# EAGLE design cnc_shield (EAGLE 5.10)
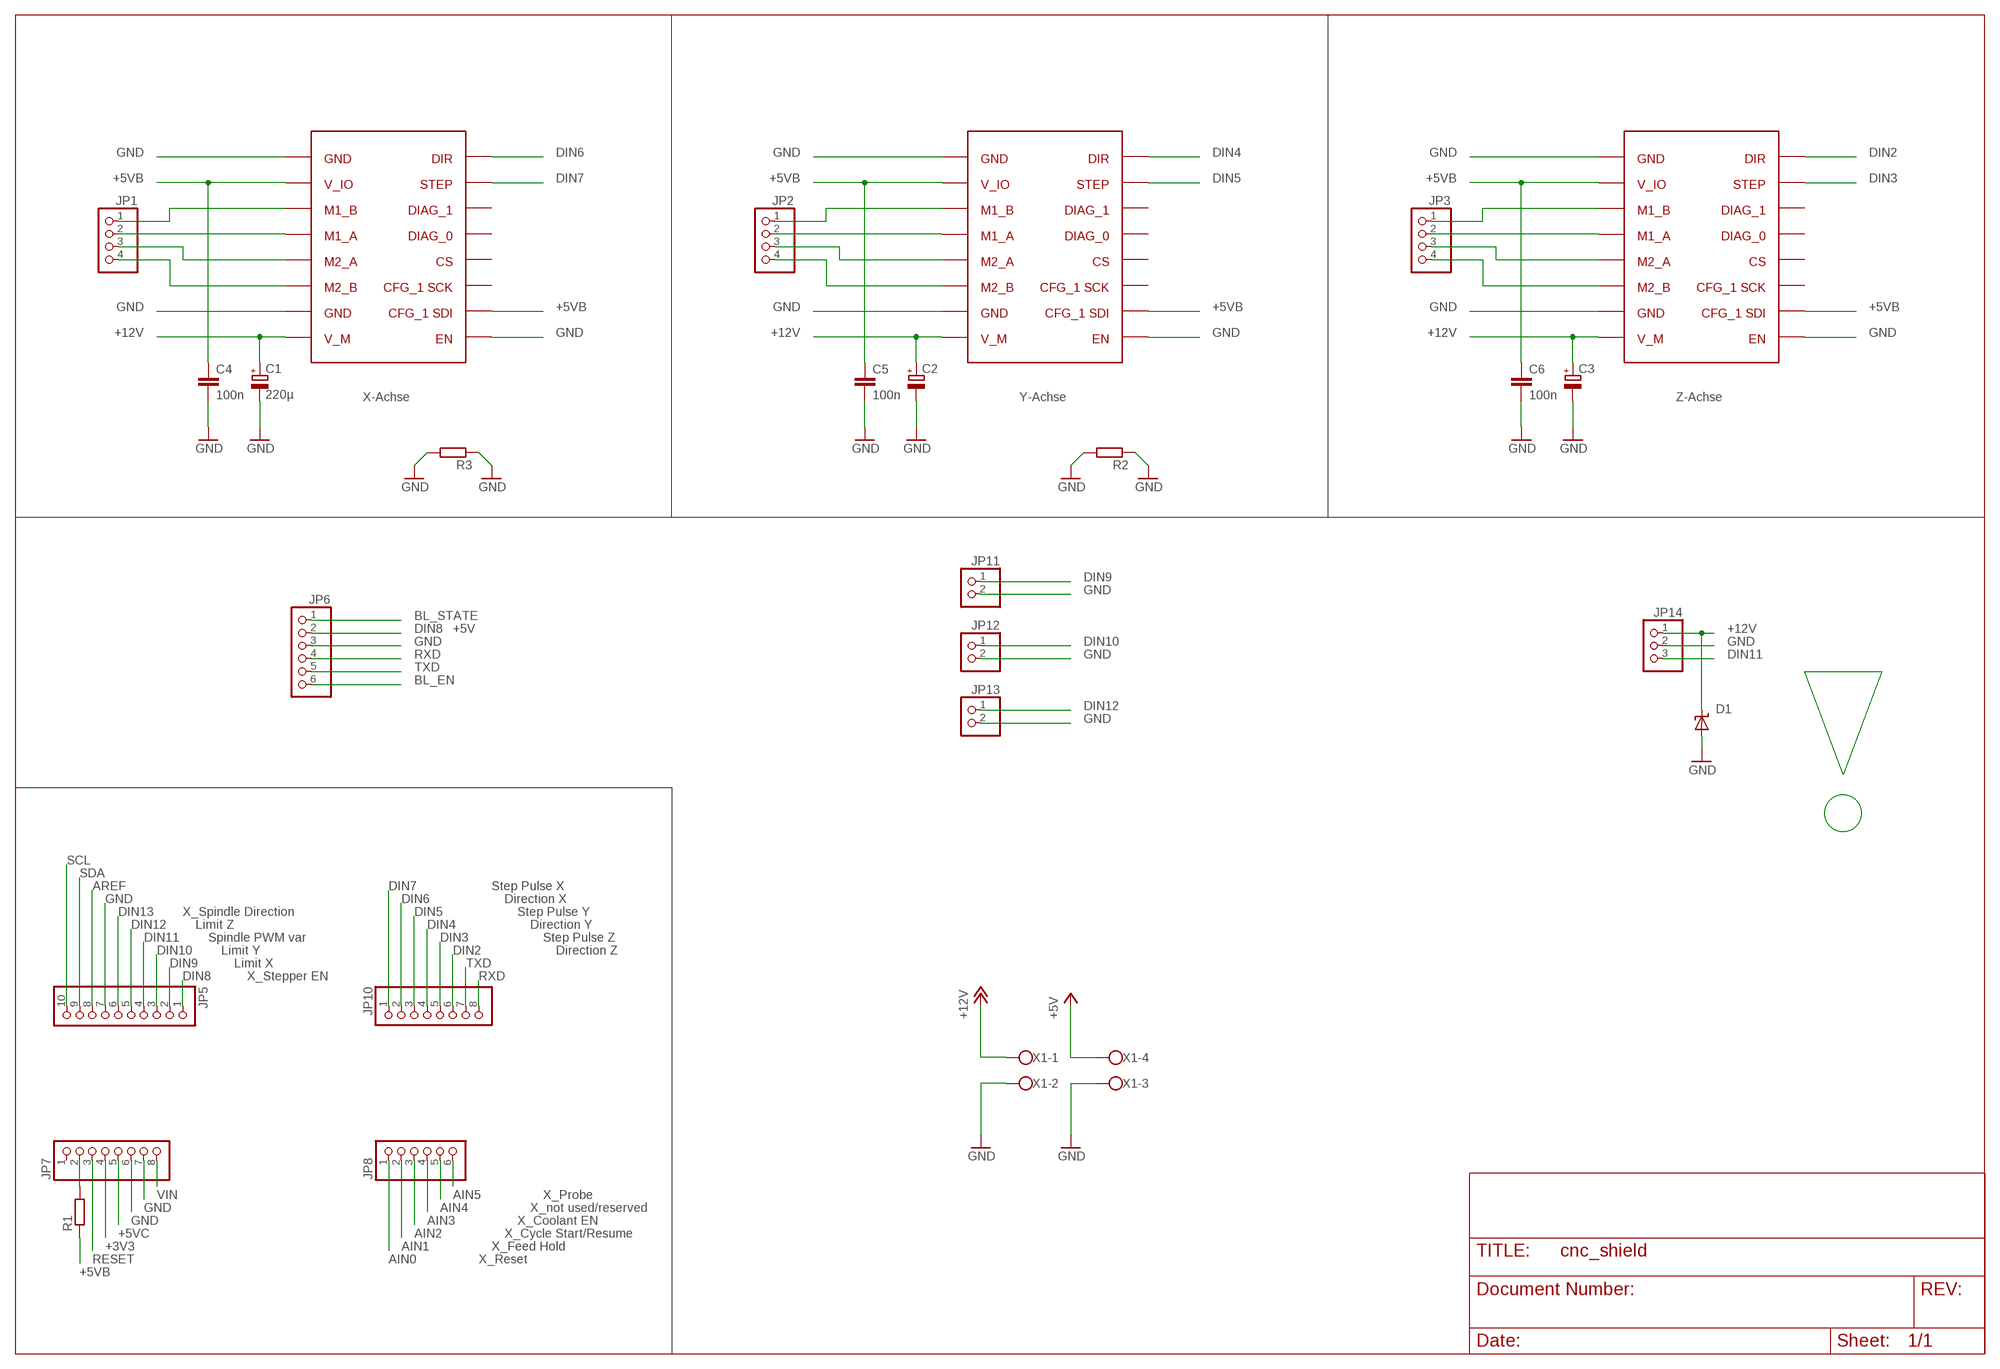
[diagram p0: schematic, sheet 1]

## Parts
C1  220µ  CPOL-EUTT2D4  [TT2D4]
C2  CPOL-EUTT2D4  [TT2D4]
C3  CPOL-EUTT2D4  [TT2D4]
C4  100n  C-EUC0805  [C0805]
C5  100n  C-EUC0805  [C0805]
C6  100n  C-EUC0805  [C0805]
D1  SUPPRESSOR-SMBG  [SMBG]
JP1  PINHD-1X4/90  [1X04/90]
JP2  PINHD-1X4/90  [1X04/90]
JP3  PINHD-1X4/90  [1X04/90]
JP5  PINHD-1X10  [1X10]
JP6  PINHD-1X6  [1X06]
JP7  PINHD-1X8  [1X08]
JP8  PINHD-1X6  [1X06]
JP10  PINHD-1X8  [1X08]
JP11  PINHD-1X2  [1X02]
JP12  PINHD-1X2  [1X02]
JP13  PINHD-1X2  [1X02]
JP14  PINHD-1X3  [1X03]
R1  R-EU_M1206  [M1206]
R2  R-EU_M1206  [M1206]
R3  R-EU_M1206  [M1206]
U$1  TMC2130  [TMC2130]
U$2  TMC2130  [TMC2130]
U$3  TMC2130  [TMC2130]
X1  W237-4  [W237-4]

## Nets
+3V3: JP7.4
+5V: JP7.2 R1.2 X1.4
+5VB: C4.1 C5.1 C6.1 R1.1 U$1.P$2(V_IO) U$1.P$10(CFG0_SDI) U$2.P$2(V_IO) U$2.P$10(CFG0_SDI) U$3.P$2(V_IO) U$3.P$10(CFG0_SDI)
+5VC: JP7.5
+12V: C1.+ C2.+ C3.+ D1.C JP14.1 U$1.P$8(V_M) U$2.P$8(V_M) U$3.P$8(V_M) X1.1
AIN0: JP8.1
AIN1: JP8.2
AIN2: JP8.3
AIN3: JP8.4
AIN4: JP8.5
AIN5: JP8.6
AREF: JP5.8
BL_EN: JP6.6
BL_STATE: JP6.1
DIN2: JP10.6 U$3.P$16(DIR)
DIN3: JP10.5 U$3.P$15(STEP)
DIN4: JP10.4 U$2.P$16(DIR)
DIN5: JP10.3 U$2.P$15(STEP)
DIN6: JP10.2 U$1.P$16(DIR)
DIN7: JP10.1 U$1.P$15(STEP)
DIN8: JP5.1 JP6.2
DIN9: JP5.2 JP11.1
DIN10: JP5.3 JP12.1
DIN11: JP5.4 JP14.3
DIN12: JP5.5 JP13.1
DIN13: JP5.6
GND: C1.- C2.- C3.- C4.2 C5.2 C6.2 D1.A JP5.7 JP6.3 JP7.6 JP7.7 JP11.2 JP12.2 JP13.2 JP14.2 R2.1 R2.2 R3.1 R3.2 U$1.P$1(GND_IO) U$1.P$7(GND_M) U$1.P$9(EN) U$2.P$1(GND_IO) U$2.P$7(GND_M) U$2.P$9(EN) U$3.P$1(GND_IO) U$3.P$7(GND_M) U$3.P$9(EN) X1.2 X1.3
N$1: JP2.1 U$2.P$3(M1B)
N$2: JP2.2 U$2.P$4(M1A)
N$3: JP1.1 U$1.P$3(M1B)
N$4: JP1.2 U$1.P$4(M1A)
N$5: JP1.3 U$1.P$5(M2A)
N$6: JP1.4 U$1.P$6(M2B)
N$7: JP2.3 U$2.P$5(M2A)
N$8: JP2.4 U$2.P$6(M2B)
N$9: JP3.1 U$3.P$3(M1B)
N$10: JP3.2 U$3.P$4(M1A)
N$11: JP3.3 U$3.P$5(M2A)
N$12: JP3.4 U$3.P$6(M2B)
RESET: JP7.3
RXD: JP6.4 JP10.8
SCL: JP5.10
SDA: JP5.9
TXD: JP6.5 JP10.7
VIN: JP7.8
Unconnected: JP7.1 U$1.P$11(CFG1_SCK) U$1.P$12(CS) U$1.P$13(DIAG_0) U$1.P$14(DIAG_1) U$2.P$11(CFG1_SCK) U$2.P$12(CS) U$2.P$13(DIAG_0) U$2.P$14(DIAG_1) U$3.P$11(CFG1_SCK) U$3.P$12(CS) U$3.P$13(DIAG_0) U$3.P$14(DIAG_1)

## Notes on the sheet
- X-Achse | Y-Achse | Z-Achse
- +5V
- Step Pulse X
- Direction X
- X_Spindle Direction | Step Pulse Y
- Limit Z | Direction Y
- Spindle PWM var | Step Pulse Z
- Limit Y | Direction Z
- Limit X
- X_Stepper EN
- X_Probe
- X_not used/reserved
- X_Coolant EN
- X_Cycle Start/Resume
- X_Feed Hold
- X_Reset

## Library data of the parts
C1-C3 = rcl:CPOL-EU: POLARIZED CAPACITOR, European symbol
C4-C6 = rcl:C-EU: CAPACITOR, European symbol
D1 = diode:SUPPRESSOR-: Suppressor diode
JP1-JP3 = pinhead:PINHD-1X4: PIN HEADER
JP5 = pinhead:PINHD-1X10: PIN HEADER
JP6 JP8 = pinhead:PINHD-1X6: PIN HEADER
JP7 JP10 = pinhead:PINHD-1X8: PIN HEADER
JP11-JP13 = pinhead:PINHD-1X2: PIN HEADER
JP14 = pinhead:PINHD-1X3: PIN HEADER
R1-R3 = rcl:R-EU_: RESISTOR, European symbol
U$1-U$3 = tmc2130:TMC2130
X1 = con-wago-500:W237-4: WAGO SCREW CLAMP

## Board
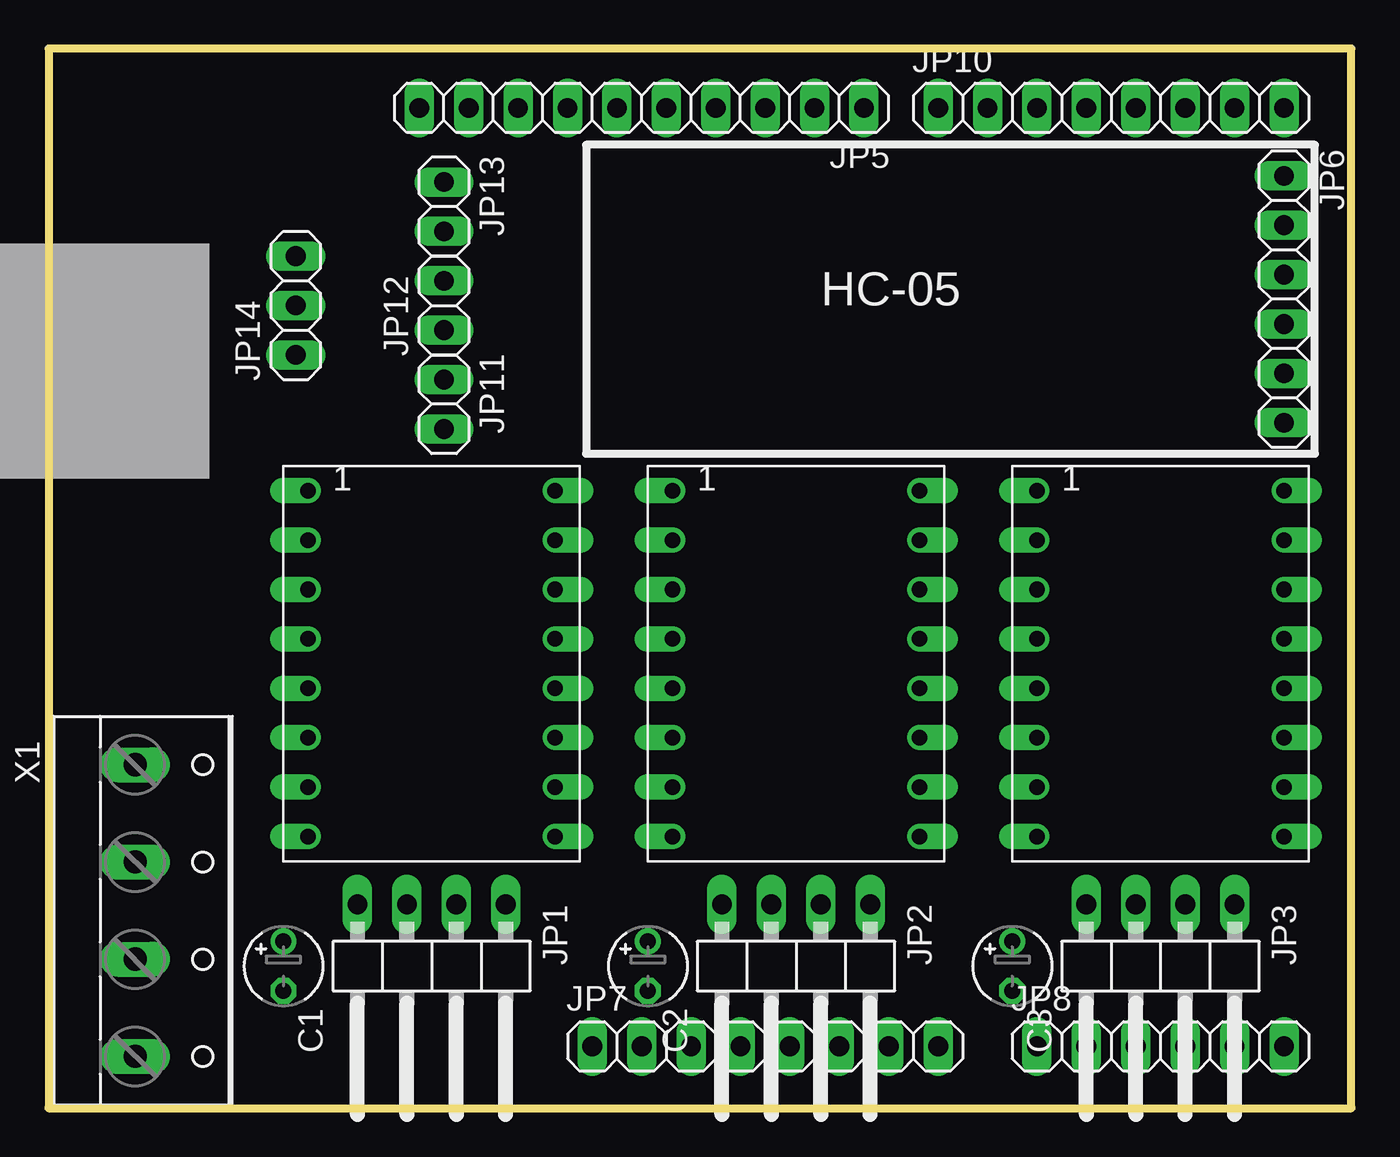
[diagram p1: board, top side]
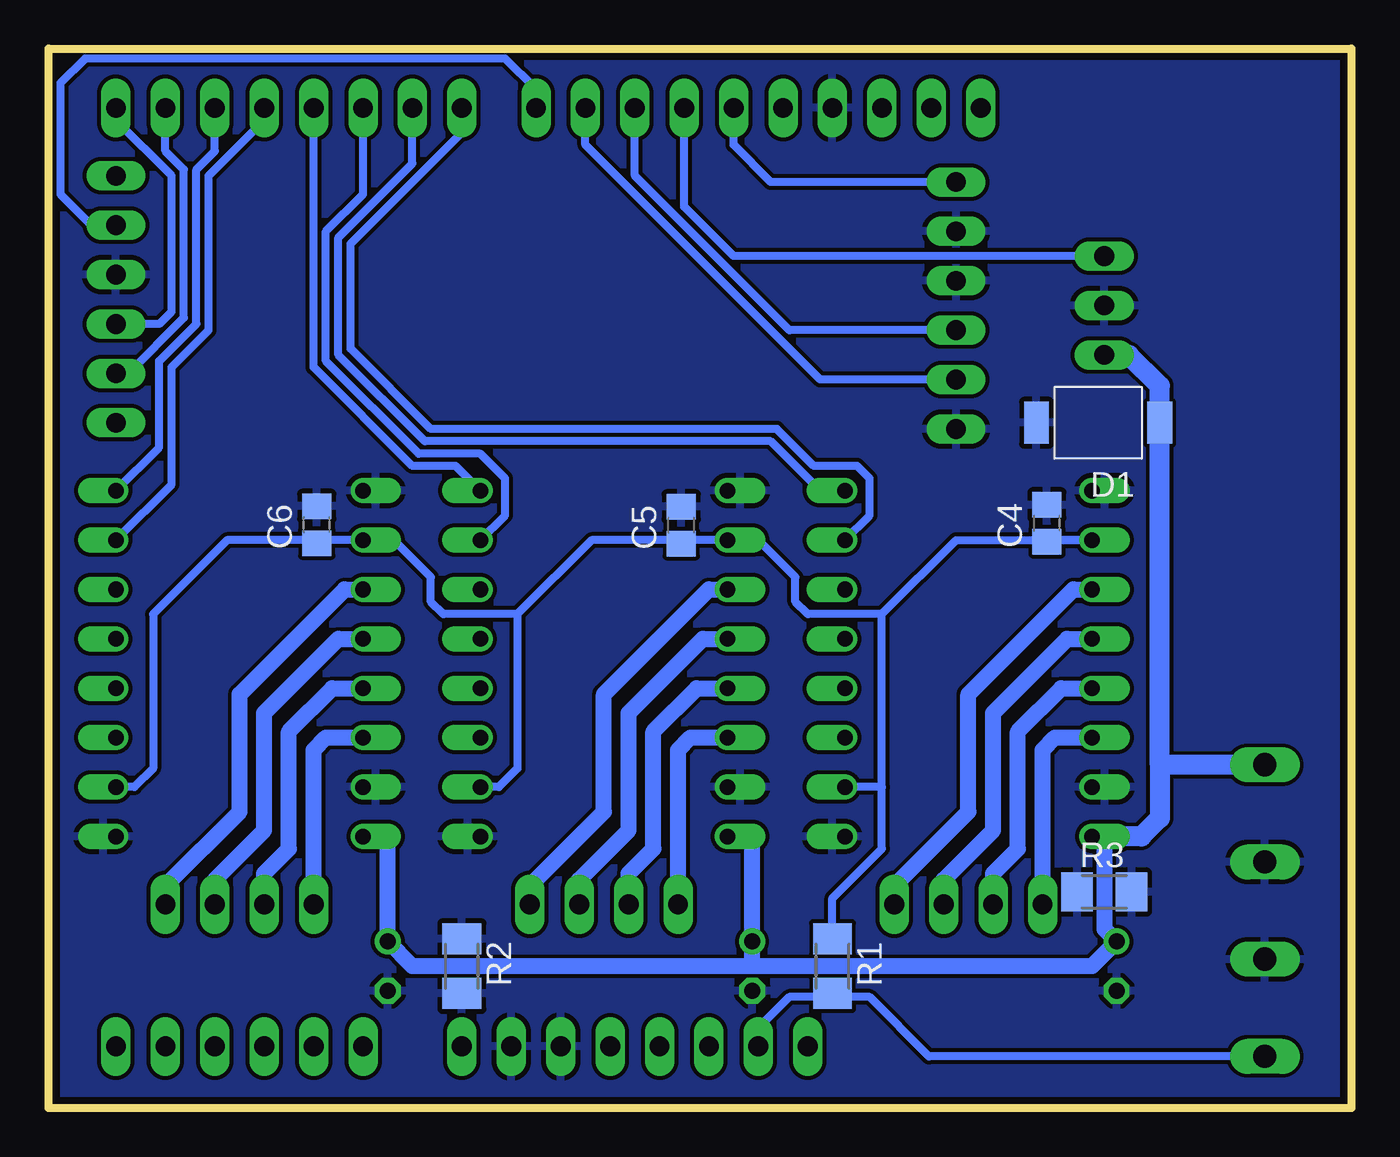
[diagram p2: board, bottom side, seen from below]

Size 66.96 x 54.48 mm. Coordinates in mm from the lower left corner, seen from the top.
Outline: 66.96,0 66.96,54.48 0,54.48 0,0 66.96,0
Copper layers (1*16): Top 0.035mm / dielectric 1.5mm / Bottom 0.035mm
Design rules "default *": minimum track width 10mil, minimum drill 24mil, track to track 8mil, track to pad 8mil, pad to pad 8mil, via to via 8mil, smd to smd 8mil, copper to edge 15mil, drill to drill 8mil, minimum pad ring 10mil, minimum via ring 8mil, stop-mask expansion 4mil, vias tented up to drill 0mil, thermal gap 10mil

### Footprints (pad centres in the part's own frame; a part is rotated, then mirrored left to right if it is on the bottom)
TT2D4 = drill 0.813 round: + -1.27,0 | drill 0.813 octagon: - 1.27,0
C0805 = smd 1.3 x 1.5: 1 -0.95,0; 2 0.95,0
SMBG = smd 1.27 x 2.16: A 3.17,0; C -3.17,0
1X04/90 = drill 1.016 long: 1 -3.81,-3.81; 2 -1.27,-3.81; 3 1.27,-3.81; 4 3.81,-3.81
1X10 = drill 1.016 long: 1 -11.43,0; 2 -8.89,0; 3 -6.35,0; 4 -3.81,0; 5 -1.27,0; 6 1.27,0; 7 3.81,0; 8 6.35,0; 9 8.89,0; 10 11.43,0
1X06 = drill 1.016 long: 1 -6.35,0; 2 -3.81,0; 3 -1.27,0; 4 1.27,0; 5 3.81,0; 6 6.35,0
1X08 = drill 1.016 long: 1 -8.89,0; 2 -6.35,0; 3 -3.81,0; 4 -1.27,0; 5 1.27,0; 6 3.81,0; 7 6.35,0; 8 8.89,0
1X02 = drill 1.016 long: 1 -1.27,0; 2 1.27,0
1X03 = drill 1.016 long: 1 -2.54,0; 2 0,0; 3 2.54,0
M1206 = smd 1.6 x 2: 1 -1.4,0; 2 1.4,0
TMC2130 = drill 0.8 offset: P$1 -6.35,8.89; P$2 -6.35,6.35; P$3 -6.35,3.81; P$4 -6.35,1.27; P$5 -6.35,-1.27; P$6 -6.35,-3.81; P$7 -6.35,-6.35; P$8 -6.35,-8.89; P$9 6.35,-8.89; P$10 6.35,-6.35; P$11 6.35,-3.81; P$12 6.35,-1.27; P$13 6.35,1.27; P$14 6.35,3.81; P$15 6.35,6.35; P$16 6.35,8.89
W237-4 = drill 1.194 long: 1 -7.5,-1.27; 2 -2.5,-1.27; 3 2.5,-1.27; 4 7.5,-1.27

### Placement (x,y rotation side)
C1  12.06,7.3 270 top
C2  30.8,7.3 270 top
C3  49.53,7.3 270 top
C4  15.65,30.07 90 bottom
C5  34.45,29.98 90 bottom
C6  53.18,30 90 bottom
D1  13.02,35.24 180 bottom
JP1  19.68,6.67 180 top
JP2  38.42,6.67 180 top
JP3  57.15,6.67 180 top
JP5  30.48,51.44 180 top
JP6  63.5,41.59 270 top
JP7  36.83,3.17 0 top
JP8  57.15,3.17 0 top
JP10  54.61,51.44 0 top
JP11  20.32,36.2 270 top
JP12  20.32,41.27 90 top
JP13  20.32,46.35 270 top
JP14  12.7,41.27 90 top
R1  26.67,7.3 270 bottom
R2  45.72,7.3 270 bottom
R3  12.7,11.11 0 bottom
U$1  19.68,22.86 0 top
U$2  38.42,22.86 0 top
U$3  57.15,22.86 0 top
X1  5.71,10.16 270 top

### Tracks (layer width: path | path; a pad name or v marks a point on that pad's centre or on a via)
+5V
  Bottom 0.406: 26.67,5.71 24.77,5.71 21.71,2.66 X1.4 | 26.67,5.71 R1.2 | 26.67,5.71 28.89,5.71 30.48,4.13 JP7.2
+5VB
  Bottom 0.406: 24.13,25.4 20.32,29.21 U$1.P$2 15.56,29.21 C4.1 | 24.13,25.4 27.94,25.4 28.57,26.04 28.57,27.3 30.48,29.21 U$2.P$2 | R1.1 26.67,10.79 24.13,13.34 24.13,16.51 | 24.13,16.51 24.13,25.4 | 24.13,16.51 U$1.P$10 | U$2.P$2 39.05,29.21 42.86,25.4 | 42.86,25.4 46.67,25.4 47.31,26.04 47.31,27.3 49.21,29.21 U$3.P$2 | 42.86,25.4 42.86,17.46 43.81,16.51 U$2.P$10 | U$3.P$2 57.78,29.21 61.59,25.4 61.59,17.46 62.55,16.51 U$3.P$10 | U$2.P$2 34.27,29.21 C5.1 | U$3.P$2 53.02,29.21 C6.1
+12V
  Bottom 0.406: 9.84,37.15 9.85,37.15 D1.C
  Bottom 0.813: U$1.P$8 12.7,13.97 12.7,9.21 C1.+ 13.34,7.3 30.8,7.3 | U$2.P$8 30.8,13.97 C2.+ 30.8,7.3 | U$3.P$8 49.53,13.97 C3.+ 48.26,7.3 30.8,7.3
  Bottom 1.016: U$1.P$8 10.79,13.97 9.84,14.92 9.84,17.66 | JP14.1 11.43,38.73 9.84,37.15 9.84,17.66 | X1.1 9.84,17.66
DIN2
  Bottom 0.406: JP10.6 58.42,49.21 59.37,48.26 59.37,40.32 61.28,38.42 61.28,33.97 U$3.P$16
DIN3
  Bottom 0.406: JP10.5 55.88,50.8 58.74,47.94 58.74,40.01 60.64,38.1 60.64,32.07 U$3.P$15
DIN4
  Bottom 0.406: U$2.P$16 46.04,33.02 48.26,33.02 53.34,38.1 JP10.4
DIN5
  Bottom 0.406: U$2.P$15 43.5,30.48 43.5,32.38 44.77,33.66 47.94,33.66 52.7,38.42 52.7,45.09 50.8,46.99 JP10.3
DIN6
  Bottom 0.406: JP10.2 48.26,48.58 52.07,44.77 52.07,38.73 47.62,34.29 29.84,34.29 27.3,31.75 U$1.P$16
DIN7
  Bottom 0.406: U$1.P$15 24.77,30.48 24.77,32.38 25.4,33.02 27.62,33.02 29.53,34.92 47.31,34.92 51.44,39.05 51.44,44.45 45.72,50.16 JP10.1
DIN8
  Bottom 0.406: JP5.1 41.91,52.39 43.5,53.98 65.09,53.98 66.36,52.7 66.36,46.99 64.77,45.4 JP6.2
DIN9
  Bottom 0.406: JP5.2 39.37,49.53 27.3,37.47 JP11.1
DIN10
  Bottom 0.406: JP5.3 36.83,47.94 28.89,40.01 JP12.1
DIN11
  Bottom 0.406: JP5.4 34.29,46.35 31.75,43.81 JP14.3
DIN12
  Bottom 0.406: JP5.5 31.75,49.53 29.84,47.62 JP13.1
GND
  pour Bottom: 0,0 66.96,0 66.96,54.48 0,54.48
N$1
  Bottom 0.813: U$2.P$3 33.02,26.67 38.42,21.27 38.42,15.24 42.23,11.43 JP2.1
N$2
  Bottom 0.813: U$2.P$4 33.34,24.13 37.15,20.32 37.15,14.29 39.69,11.75 JP2.2
N$3
  Bottom 0.813: U$1.P$3 14.29,26.67 19.68,21.27 19.68,15.24 23.5,11.43 JP1.1
N$4
  Bottom 0.813: U$1.P$4 14.61,24.13 18.41,20.32 18.41,14.29 20.95,11.75 JP1.2
N$5
  Bottom 0.813: U$1.P$5 14.92,21.59 17.14,19.37 17.14,13.34 18.41,12.06 JP1.3
N$6
  Bottom 0.813: U$1.P$6 15.24,19.05 15.88,18.41 JP1.4
N$7
  Bottom 0.813: U$2.P$5 33.66,21.59 35.88,19.37 35.88,13.34 37.15,12.06 JP2.3
N$8
  Bottom 0.813: U$2.P$6 33.97,19.05 34.61,18.41 JP2.4
N$9
  Bottom 0.813: U$3.P$3 51.75,26.67 57.15,21.27 57.15,15.24 60.96,11.43 JP3.1
N$10
  Bottom 0.813: U$3.P$4 52.07,24.13 55.88,20.32 55.88,14.29 58.42,11.75 JP3.2
N$11
  Bottom 0.813: U$3.P$5 52.39,21.59 54.61,19.37 54.61,13.34 55.88,12.06 JP3.3
N$12
  Bottom 0.813: U$3.P$6 52.7,19.05 53.34,18.41 JP3.4
RXD
  Bottom 0.406: JP10.8 63.5,50.8 60.64,47.94 60.64,40.96 61.28,40.32 JP6.4
TXD
  Bottom 0.406: JP10.7 60.96,49.21 60.01,48.26 60.01,40.64 62.87,37.78 JP6.5

### Text on the board
tPlace: USB | HC-05
tDocu: Limit Z | ESC | Limit Y | Limit X | X | Y | Z | +12V | +5V